# Altium schematic sheet CATS_GS-Radio_MCU.SchDoc: CATS Groundstation
size A4; DocumentNumber: Subtitle; Revision: V1.0; SheetNumber: 7; SheetTotal: 9; Author: Luca Jost; Subtitle: Radio MCU
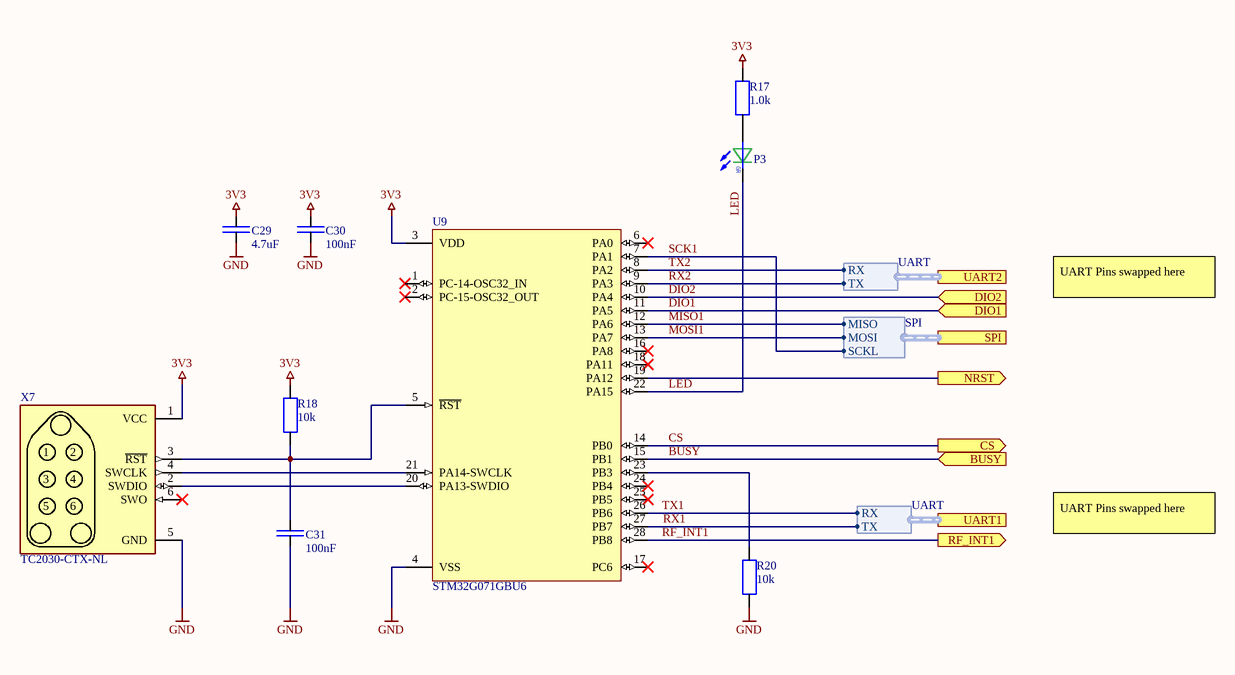
[diagram p0: CATS_GS-Radio_MCU.SchDoc]

## Parts
C29  4.7uF  [SMD Keramikkondensator 0402]
C30  100nF  [SMD Keramikkondensator 0402]
C31  100nF  [SMD Keramikkondensator 0402]
P3  LED  [SMD LED 0603]  (value not drawn)
R17  1.0k  [SMD Widerstand 0402]
R18  10k  [SMD Widerstand 0402]
R20  10k  [SMD Widerstand 0402]
U9  STM32G071GBU6  [SMD IC QFN-28 4x4 0.5 Pitch]
X7  TC2030-CTX-NL  [SMD Connector TC2030]  (no BOM)

## Ports
BUSY (in), CS (out), DIO1 (in), DIO2 (in), NRST (out), RF_INT1 (out), SPI (harness SPI), UART1 (harness UART), UART2 (harness UART)

## Harnesses
SPI: SCKL, MOSI, MISO
UART: RX, TX

## Nets
3V3: C29.2 C30.2 R17.2 R18.2 U9.3(VDD) X7.1(VCC)
GND: C29.1 C30.1 C31.1 R20.1 U9.4(VSS) X7.5(GND)
BUSY: U9.15(PB1) ; port BUSY
CS: U9.14(PB0) ; port CS
DIO1: U9.11(PA5) ; port DIO1
DIO2: U9.10(PA4) ; port DIO2
LED: P3.K U9.22(PA15)
MISO1: U9.12(PA6) ; port SPI.MISO
MOSI1: U9.13(PA7) ; port SPI.MOSI
NRST: U9.19(PA12) ; port NRST
RF_INT1: U9.28(PB8) ; port RF_INT1
RX1: U9.27(PB7) ; port UART1.TX
RX2: U9.9(PA3) ; port UART2.TX
SCK1: U9.7(PA1) ; port SPI.SCKL
TX1: U9.26(PB6) ; port UART1.RX
TX2: U9.8(PA2) ; port UART2.RX
NetC31_2: C31.2 R18.1 U9.5(~{RST}) X7.3(~{RST})
NetP3_A: P3.A R17.1
NetR20_2: R20.2 U9.23(PB3)
NetU9_20: U9.20(PA13-SWDIO) X7.2(SWDIO)
NetU9_21: U9.21(PA14-SWCLK) X7.4(SWCLK)

Not connected (* = marked no-connect by the designer): U9 1(PC-14-OSC32_IN)* 2(PC-15-OSC32_OUT)* 6(PA0)* 16(PA8)* 17(PC6)* 18(PA11)* 24(PB4)* 25(PB5)*; X7 6(SWO)*

## Notes on the sheet
- UART Pins swapped here
- Title
- Author:
- Subtitle
- Date:
- Rev:
- File:
- Sheet
- of
- (in symbol LED) GR

## Library data of the parts
C29 = E6 - 4.7uF: SMD Ceramic Capacitor E6; Unit Price: 0.01; JLC: C23733
C30 C31 = E6 - 100nF: SMD Ceramic Capacitor E6; Unit Price: 0.01; JLC: C307331
P3 = LED: Color LED; JLC: C72043
R17 = E24 - 1.0k: SMD Chip Resistor E24; Unit Price: 0.01; JLC: C11702
R18 R20 = E24 - 10k: SMD Chip Resistor E24; Unit Price: 0.01; JLC: C25744
U9 = STM32G071GBU6: ARM® Cortex®-M0+ series Microcontroller IC 32-Bit 64MHz 128KB (128K x 8) FLASH 28-UFQFPN (4x4); Digikey: 497-18343-ND; JLC: C529347; ComponentLink1Description: Datasheet; ComponentLink1URL: https://media.digikey.com/pdf/Data%20Sheets/ST%20Microelectronics%20PDFS/STM32G071_Rev1_DS.pdf; Unit Price: 4.07
X7 = TC2030-CTX-NL: Tag-Connect for ARM-Cortex (6-Pin); Unit Price: 0.00